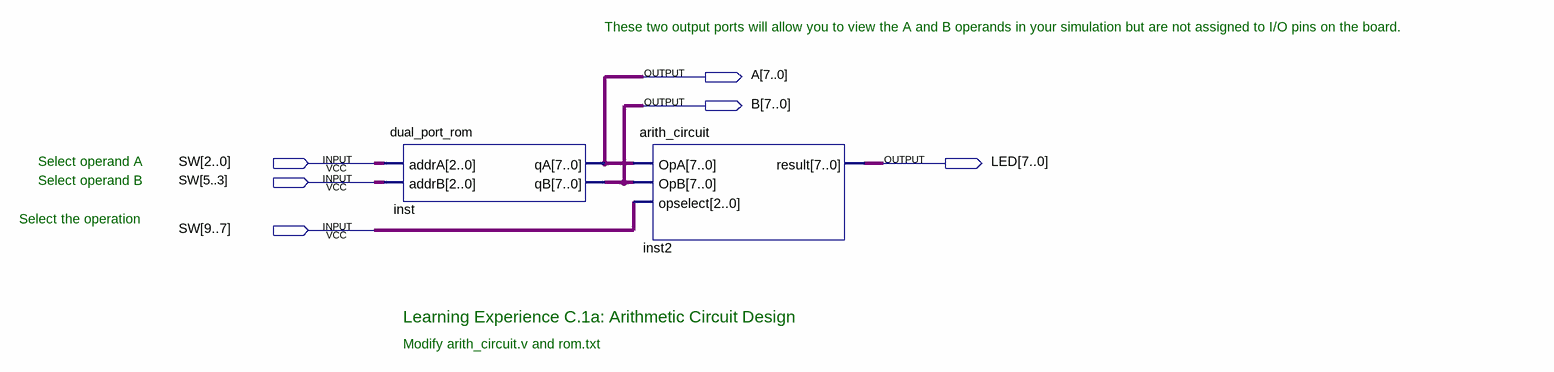
[diagram p0: schematic sheet]
// Quartus schematic LE_C1a.bdf as structural Verilog: 2 symbols, 6 pins
module LE_C1a (
  input  [9:0] SW,
  output [7:0] A,
  output [7:0] B,
  output [7:0] LED
);

  dual_port_rom inst (.addrA(SW[2:0]), .addrB(SW[5:3]), .qA(A), .qB(B));
  arith_circuit inst2 (.OpA(A), .OpB(B), .opselect(SW[9:7]), .result(LED));

  // Notes on the sheet:
  //   These two output ports will allow you to view the A and B operands in your simulation but are not assigned to I/O pins on the board.
  //   Select operand A
  //   Select operand B
  //   Select the operation
  //   Learning Experience C.1a: Arithmetic Circuit Design
  //   Modify arith_circuit.v and rom.txt
endmodule
